# EAGLE design MainSCH (EAGLE 9.5.2)
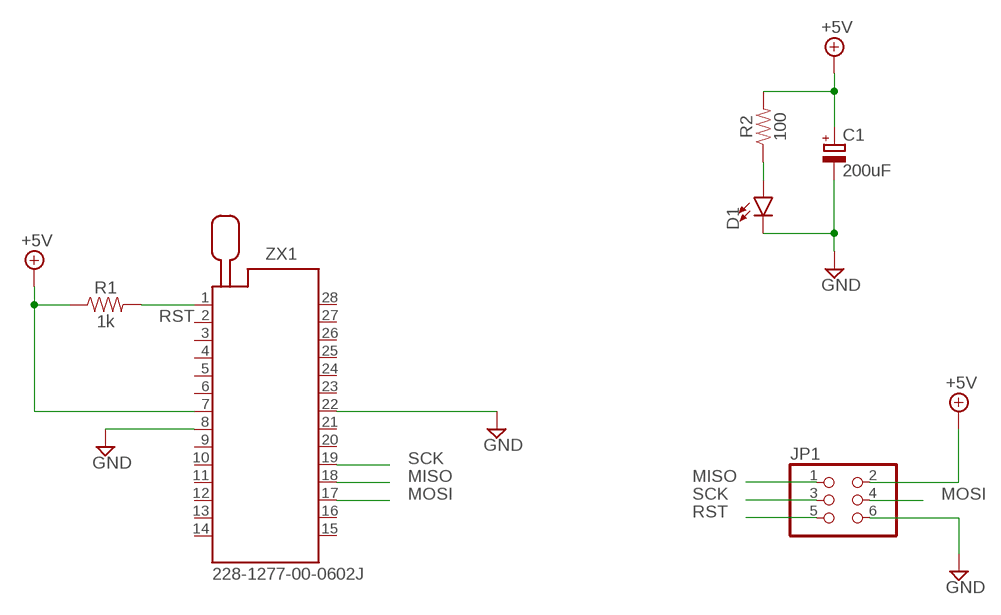
[diagram p0: schematic, sheet 1]

## Parts
C1  200uF  CPOL-EUE2.5-6  [E2,5-6]
D1  LED0603  [LED-0603]
JP1  PINHD-2X3  [2X03]
R1  1k  1KOHM-0603-1/10W-1%  [0603]
R2  100  100OHM-0603-1/10W-1%  [0603]
ZX1  228-1277-00-0602J  [228-1277-00-0602J]

## Nets
+5V: C1.+ JP1.2 R1.1 R2.2 ZX1.7
GND: C1.- D1.C JP1.6 ZX1.8 ZX1.22
MISO: JP1.1 ZX1.18
MOSI: JP1.4 ZX1.17
N$1: D1.A R2.1
RST: JP1.5 R1.2 ZX1.1
SCK: JP1.3 ZX1.19
Unconnected: ZX1.2 ZX1.3 ZX1.4 ZX1.5 ZX1.6 ZX1.9 ZX1.10 ZX1.11 ZX1.12 ZX1.13 ZX1.14 ZX1.15 ZX1.16 ZX1.20 ZX1.21 ZX1.23 ZX1.24 ZX1.25 ZX1.26 ZX1.27 ZX1.28

## Library data of the parts
C1 = rcl:CPOL-EU: POLARIZED CAPACITOR, European symbol; SPICEPREFIX: C
D1 = SparkFun-LED:LED: LED (Generic) Standard schematic elements and footprints for 5mm, 3mm, 1206, and 0603 sized LEDs. Generic LEDs with no color specified.
JP1 = pinhead:PINHD-2X3: PIN HEADER
R1 = SparkFun-Resistors:1KOHM: 1kΩ resistor A resistor is a passive two-terminal electrical component that implements electrical resistance as a circuit element. Resistors act to reduce current flow, and, at the same time, act to lower voltage levels within circuits. - Wikipedia; PROD_ID: RES-07856
R2 = SparkFun-Resistors:100OHM: 100Ω resistor A resistor is a passive two-terminal electrical component that implements electrical resistance as a circuit element. Resistors act to reduce current flow, and, at the same time, act to lower voltage levels within circuits. - Wikipedia; PROD_ID: RES-07863
ZX1 = con-3m:228-?00-0602J: Zero Insertion Force Socked Source: http://www.3M.com/ehpd; MF: 3M; MPN: 228-1277-00-0602J; OC_FARNELL: 9897356; OC_NEWARK: 85K7825

## Net classes
0 default: width 0.305 mm, drill 0.508 mm, clearance 0.254 mm

## Board
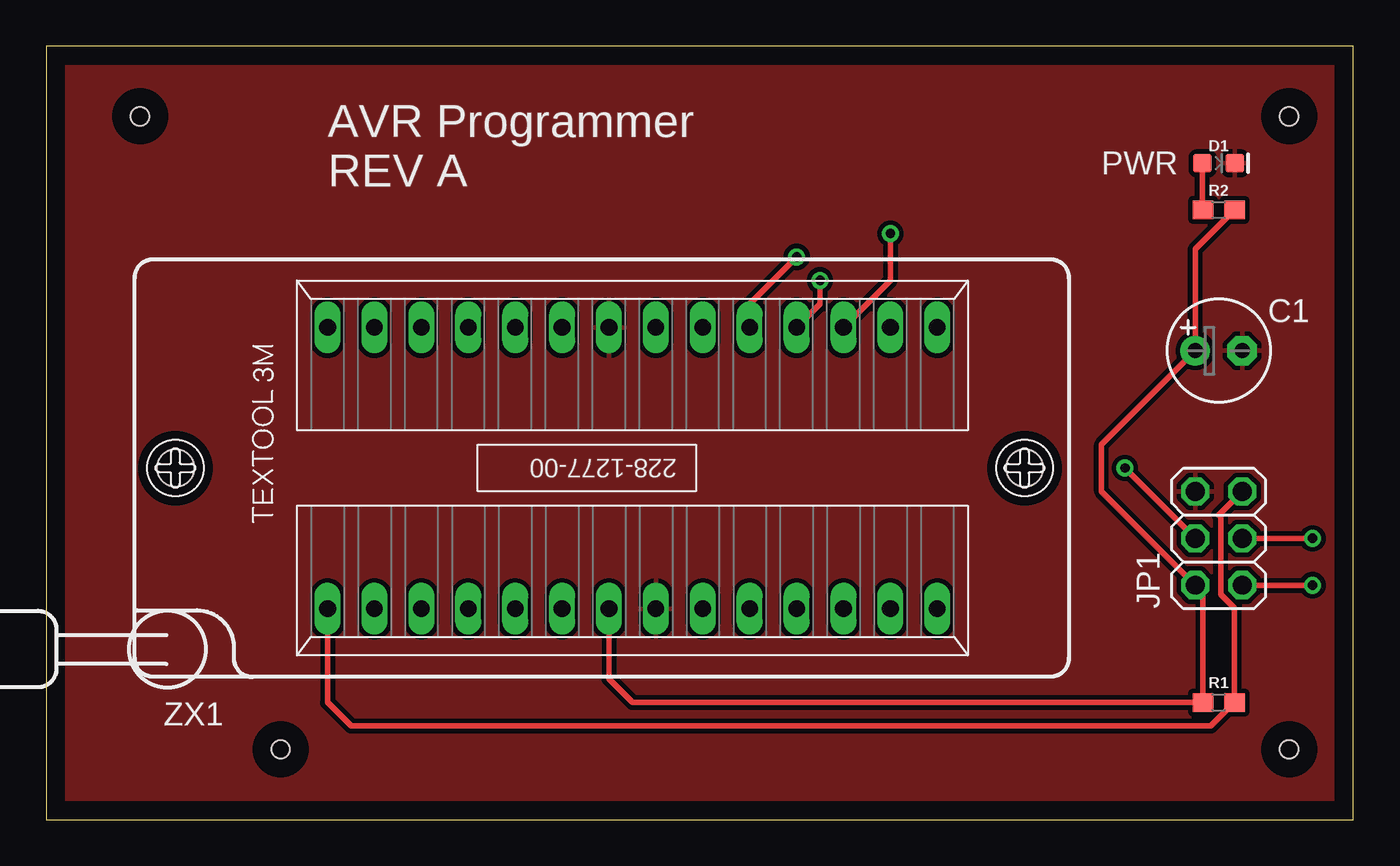
[diagram p1: board, top side]
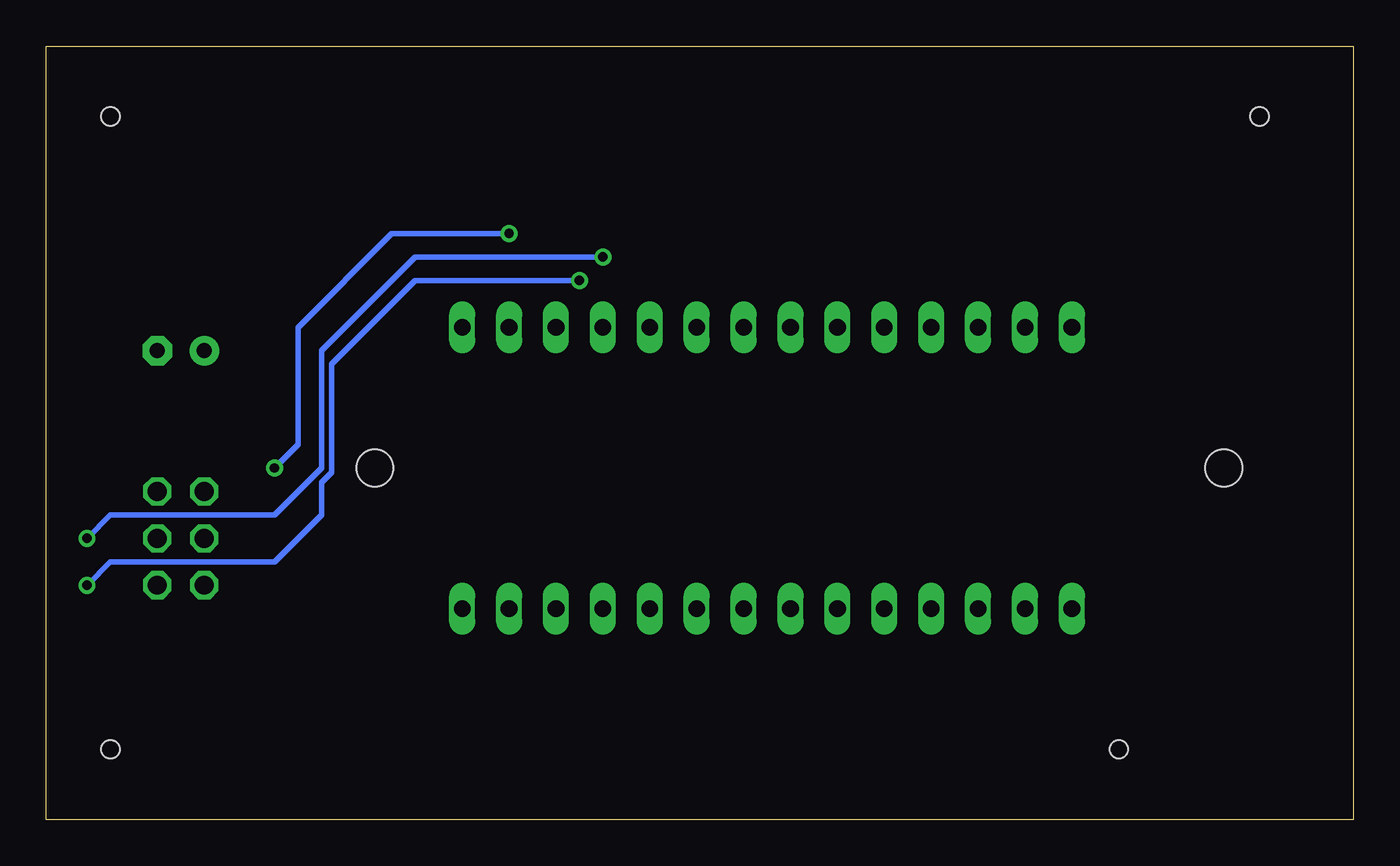
[diagram p2: board, bottom side, seen from below]

Size 70.79 x 41.9 mm. Coordinates in mm from the lower left corner, seen from the top.
Outline: 0,0 70.79,0 70.79,41.9 0,41.9 0,0
Copper layers (1*16): Top 0.035mm / dielectric 1.5mm / Bottom 0.035mm
Design rules "default": minimum track width 6mil, minimum drill 0.35mm, track to track 6mil, track to pad 6mil, pad to pad 6mil, via to via 6mil, smd to smd 6mil, copper to edge 40mil, drill to drill 6mil, minimum pad ring 10mil, minimum via ring 8mil, stop-mask expansion 4mil, vias tented up to drill 0mil, thermal gap 10mil
Holes 1 mm at 5.08,38.1 12.7,3.81 67.31,3.81 67.31,38.1

### Footprints (pad centres in the part's own frame; a part is rotated, then mirrored left to right if it is on the bottom)
E2,5-6 = drill 0.813 pad 1.6: + -1.27,0 | drill 0.813 pad 1.6 octagon: - 1.27,0
LED-0603 = smd 1 x 1: A -0.877,0; C 0.877,0
2X03 = drill 1.016 octagon: 1 -2.54,-1.27; 2 -2.54,1.27; 3 0,-1.27; 4 0,1.27; 5 2.54,-1.27; 6 2.54,1.27
0603 = smd 1.1 x 1: 1 -0.85,0; 2 0.85,0
228-1277-00-0602J = drill 0.9 long: 1 -16.51,-7.62; 2 -13.97,-7.62; 3 -11.43,-7.62; 4 -8.89,-7.62; 5 -6.35,-7.62; 6 -3.81,-7.62; 7 -1.27,-7.62; 8 1.27,-7.62; 9 3.81,-7.62; 10 6.35,-7.62; 11 8.89,-7.62; 12 11.43,-7.62; 13 13.97,-7.62; 14 16.51,-7.62; 15 16.51,7.62; 16 13.97,7.62; 17 11.43,7.62; 18 8.89,7.62; 19 6.35,7.62; 20 3.81,7.62; 21 1.27,7.62; 22 -1.27,7.62; 23 -3.81,7.62; 24 -6.35,7.62; 25 -8.89,7.62; 26 -11.43,7.62; 27 -13.97,7.62; 28 -16.51,7.62 | hole 2: 21.24,0; -24.74,0

### Placement (x,y rotation side)
C1  63.5,25.4 0 top
D1  63.5,35.56 0 top
JP1  63.5,15.24 90 top
R1  63.5,6.35 0 top
R2  63.5,33.02 0 top
ZX1  31.75,19.05 0 top

### Tracks (layer width: path | path; a pad name or v marks a point on that pad's centre or on a via)
+5V
  Top 0.305: R2.2 62.23,30.9 C1.+ 57.15,20.32 57.15,17.78 JP1.2 62.65,12.28 R1.1 31.75,6.35 30.48,7.62 ZX1.7
GND
  pour Top: 0,0 0,41.91 71.12,41.91 71.12,0
MISO  (via drill 0.51)
  Top 0.305: JP1.1 v68.58,12.7 | v41.91,29.21 41.91,27.94 ZX1.18
  Bottom 0.305: v68.58,12.7 67.31,13.97 58.42,13.97 55.88,16.51 55.88,18.26 55.32,18.82 55.32,24.69 50.8,29.21 v41.91,29.21
MOSI  (via drill 0.51)
  Top 0.305: JP1.4 v58.42,19.05 | v45.72,31.75 45.72,29.21 ZX1.17
  Bottom 0.305: v45.72,31.75 52.07,31.75 57.15,26.67 57.15,20.32 v58.42,19.05
N$1
  Top 0.305: R2.1 62.62,33.05 D1.A
RST
  Top 0.305: JP1.5 63.5,16.51 63.6,16.41 63.6,12.22 64.35,11.47 R1.2 63.08,5.08 16.51,5.08 15.24,6.35 ZX1.1
SCK  (via drill 0.51)
  Top 0.305: JP1.3 v68.58,15.24 | v40.64,30.48 38.1,27.94 ZX1.19
  Bottom 0.305: v68.58,15.24 67.31,16.51 58.42,16.51 55.88,19.05 55.88,25.4 50.8,30.48 v40.64,30.48

### Text on the board
tPlace: PWR | AVR Programmer / REV A